# EAGLE design iv12-driver-board-v1 (EAGLE 7.7.0)

## Sheet 1 of 2
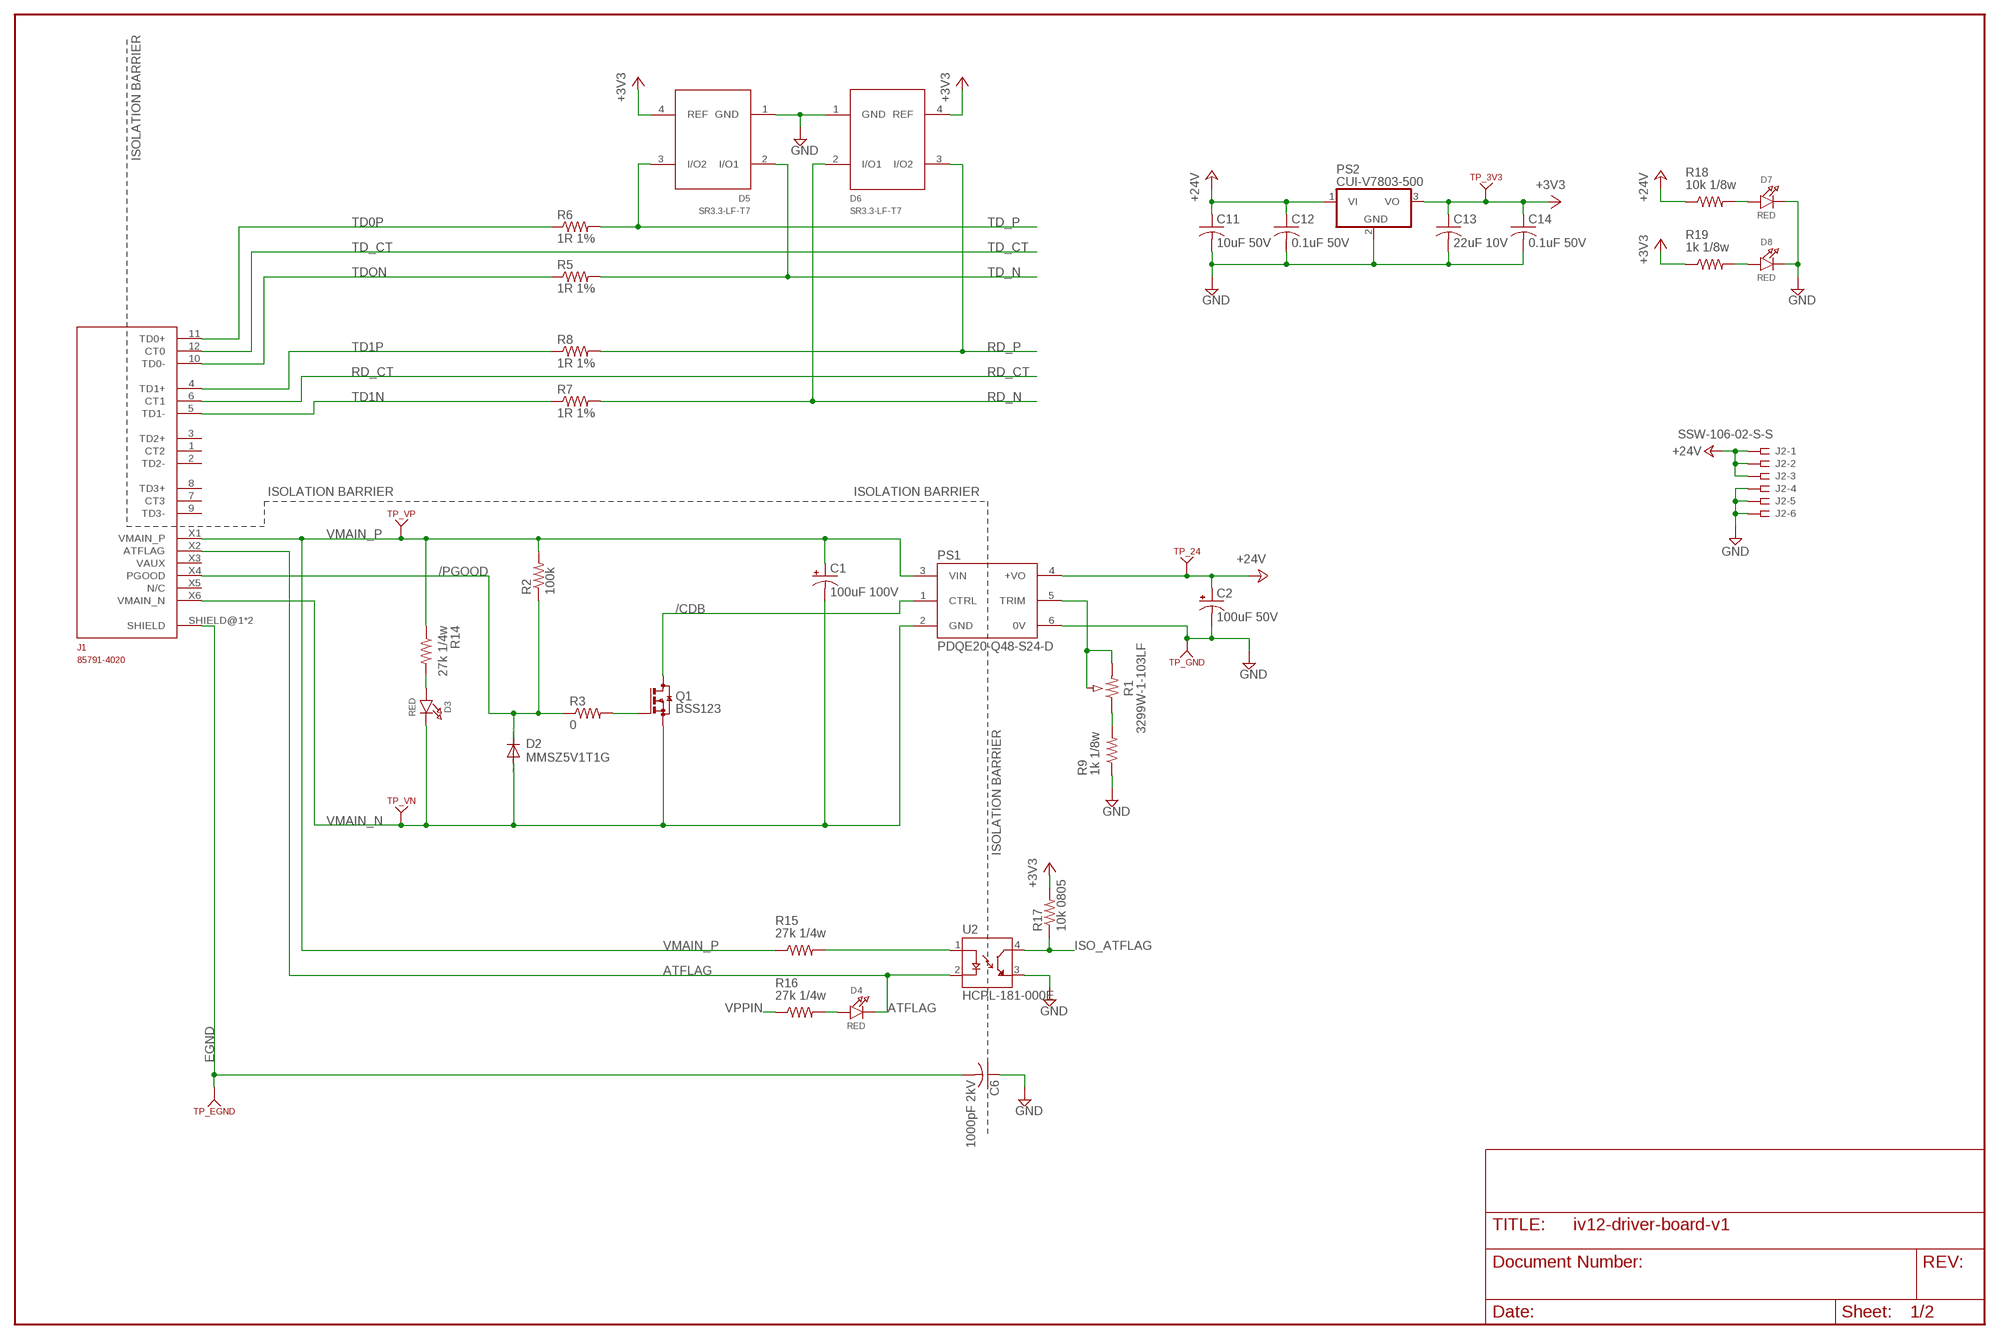
[diagram p0: schematic, sheet 1]

### Parts
C1  100uF 100V  CPOL-USE5-13  [E5-13]
C2  100uF 50V  CPOL-USE5-10.5  [E5-10,5]
C6  1000pF 2kV  C-USC1206K  [C1206K]
C11  10uF 50V  C-USC1210K  [C1210K]
C12  0.1uF 50V  C-USC0805  [C0805]
C13  22uF 10V  C-USC1206K  [C1206K]
C14  0.1uF 50V  C-USC0805  [C0805]
D2  MMSZ5V1T1G  DIODE-SOD123  [SOD123]
D3  RED  LED0805_NOOUTLINE  [CHIPLED_0805_NOOUTLINE]
D4  RED  LED0805_NOOUTLINE  [CHIPLED_0805_NOOUTLINE]
D5  SR3.3-LF-T7  [SOT143B]
D6  SR3.3-LF-T7  [SOT143B]
D7  RED  LED0805_NOOUTLINE  [CHIPLED_0805_NOOUTLINE]
D8  RED  LED0805_NOOUTLINE  [CHIPLED_0805_NOOUTLINE]
J1  85791-4020  [85791-X020]
J2  SSW-106-02-S-S  [SSW-106-02-S-S]
PS1  PDQE20-Q48-S24-D  PDQE20-Q48-S5-D  [CONV_PDQE20-Q48-S5-D]
PS2  CUI-V7803-500  [CUI-78XX-500]
Q1  BSS123  [SOT23]
R1  3299W-1-103LF  [POT_3299W]
R2  100k  R-US_R0805  [R0805]
R3  0  R-US_R0805  [R0805]
R5  1R 1%  R-US_R0805  [R0805]
R6  1R 1%  R-US_R0805  [R0805]
R7  1R 1%  R-US_R0805  [R0805]
R8  1R 1%  R-US_R0805  [R0805]
R9  1k 1/8w  R-US_R0805  [R0805]
R14  27k 1/4w  R-US_R1206  [R1206]
R15  27k 1/4w  R-US_R1206  [R1206]
R16  27k 1/4w  R-US_R1206  [R1206]
R17  10k 0805  R-US_R0805  [R0805]
R18  10k 1/8w  R-US_R0805  [R0805]
R19  1k 1/8w  R-US_R0805  [R0805]
TP_3V3  KEYSTONE_500X  [KEYSTONE_TP500X]
TP_24  KEYSTONE_500X  [KEYSTONE_TP500X]
TP_EGND  KEYSTONE_500X  [KEYSTONE_TP500X]
TP_GND  KEYSTONE_500X  [KEYSTONE_TP500X]
TP_VN  KEYSTONE_500X  [KEYSTONE_TP500X]
TP_VP  KEYSTONE_500X  [KEYSTONE_TP500X]
U2  HCPL-181-000E  [SOIC254P675X240-4N]

### Nets
+3V3: C13.1 C14.1 D5.4(REF) D6.4(REF) PS2.3(VO) R17.2 R19.1 TP_3V3.1 ; also sheet 2
+24V: C2.+ C11.1 C12.1 J2.1 J2.2 J2.3 PS1.4(+VO) PS2.1(VI) R18.1 TP_24.1
/CDB: PS1.1(CTRL) Q1.3(D)
/PGOOD: D2.C J1.X4(PGOOD) R2.1 R3.1
ATFLAG: D4.C J1.X2(ATFLAG) U2.2(CATHODE)
EGND: C6.2 J1.SHIELD@1(SHIELD) J1.SHIELD@2(SHIELD) TP_EGND.1
GND: C2.- C6.1 C11.2 C12.2 C13.2 C14.2 D5.1(GND) D6.1(GND) D7.C D8.C J2.4 J2.5 J2.6 PS1.6(0V) PS2.2(GND) R9.1 TP_GND.1 U2.3(EMITTER) ; also sheet 2
ISO_ATFLAG: R17.1 U2.4(COLLECTOR) ; also sheet 2
N$7: R1.1 R9.2
N$12: R15.2 U2.1(ANODE)
N$16: Q1.1(G) R3.2
N$22: D3.A R14.2
N$23: D4.A R16.2
N$24: D7.A R18.2
N$25: D8.A R19.2
RD_CT: J1.6(CT1) ; also sheet 2
RD_N: D6.2(I/O1) R7.2 ; also sheet 2
RD_P: D6.3(I/O2) R8.2 ; also sheet 2
TD0P: J1.11(TD0+) R6.1
TD1N: J1.5(TD1-) R7.1
TD1P: J1.4(TD1+) R8.1
TD_CT: J1.12(CT0) ; also sheet 2
TD_N: D5.2(I/O1) R5.2 ; also sheet 2
TD_P: D5.3(I/O2) R6.2 ; also sheet 2
TDON: J1.10(TD0-) R5.1
V24ADJ: PS1.5(TRIM) R1.2 R1.3
VMAIN_N: C1.- D2.A D3.C J1.X6(VMAIN_N) PS1.2(GND) Q1.2(S) TP_VN.1
VMAIN_P: C1.+ J1.X1(VMAIN_P) PS1.3(VIN) R2.2 R14.1 R15.1 TP_VP.1
VPPIN: R16.1
Unconnected: J1.1(CT2) J1.2(TD2-) J1.3(TD2+) J1.7(CT3) J1.8(TD3+) J1.9(TD3-) J1.X3(VAUX) J1.X5(N/C)

### Notes on the sheet
- ISOLATION BARRIER
- ISOLATION BARRIER | ISOLATION BARRIER
- ISOLATION BARRIER

## Sheet 2 of 2
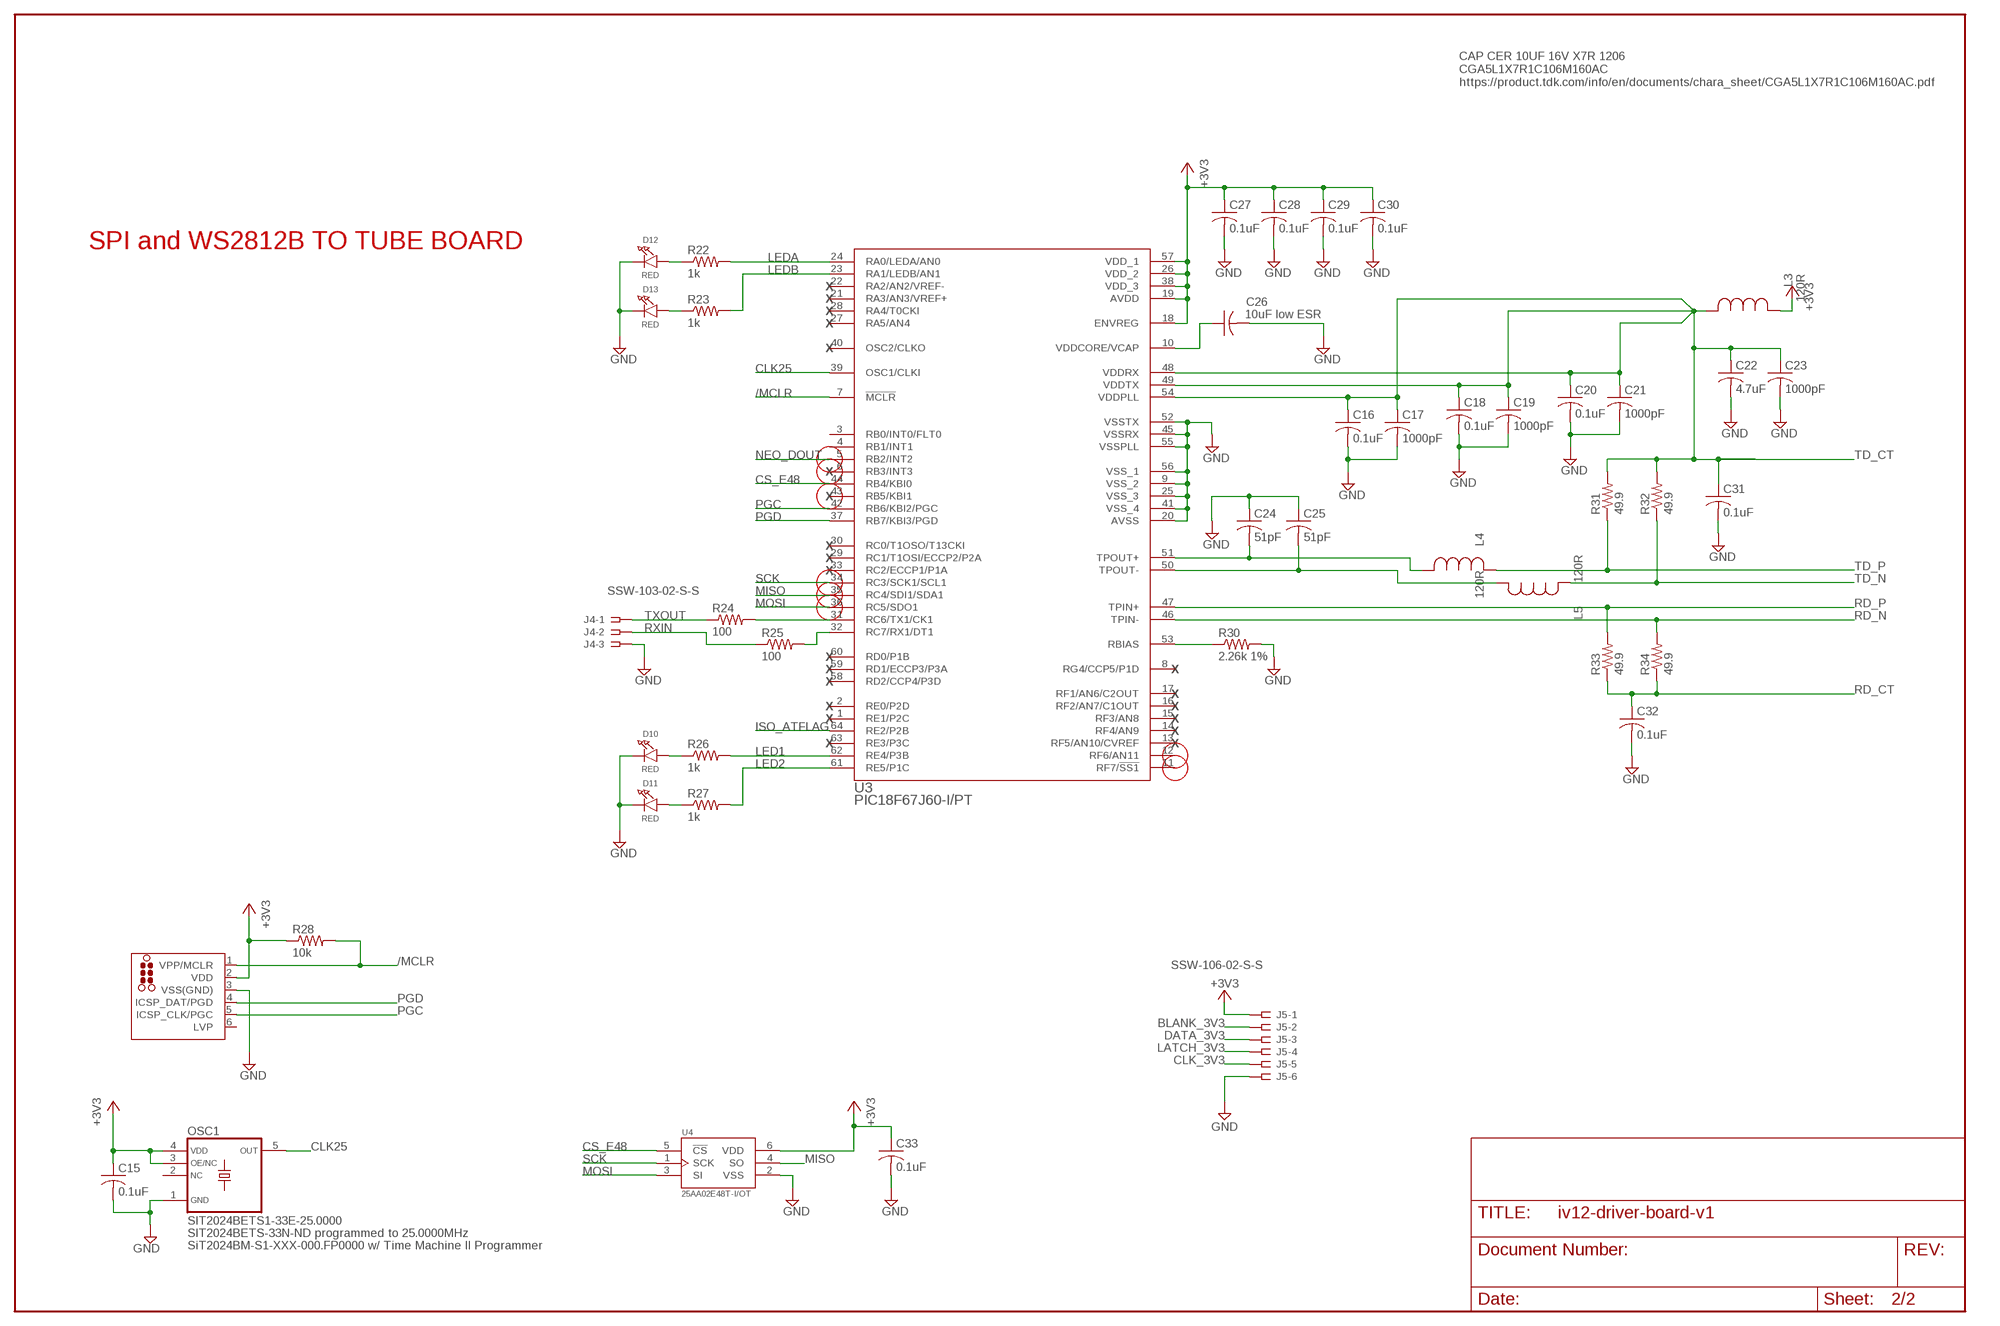
[diagram p1: schematic, sheet 2]

### Parts
C15  0.1uF  C-USC0603  [C0603]
C16  0.1uF  C-USC0805  [C0805]
C17  1000pF  C-USC0805  [C0805]
C18  0.1uF  C-USC0805  [C0805]
C19  1000pF  C-USC0805  [C0805]
C20  0.1uF  C-USC0805  [C0805]
C21  1000pF  C-USC0805  [C0805]
C22  4.7uF  C-USC0805  [C0805]
C23  1000pF  C-USC0805  [C0805]
C24  51pF  C-USC0805  [C0805]
C25  51pF  C-USC0805  [C0805]
C26  10uF low ESR  C-USC1206  [C1206]
C27  0.1uF  C-USC0603  [C0603]
C28  0.1uF  C-USC0603  [C0603]
C29  0.1uF  C-USC0603  [C0603]
C30  0.1uF  C-USC0603  [C0603]
C31  0.1uF  C-USC0805  [C0805]
C32  0.1uF  C-USC0805  [C0805]
C33  0.1uF  C-USC0603  [C0603]
D10  RED  LED0805_NOOUTLINE  [CHIPLED_0805_NOOUTLINE]
D11  RED  LED0805_NOOUTLINE  [CHIPLED_0805_NOOUTLINE]
D12  RED  LED0805_NOOUTLINE  [CHIPLED_0805_NOOUTLINE]
D13  RED  LED0805_NOOUTLINE  [CHIPLED_0805_NOOUTLINE]
J3  TC2030-MCP-NL  [TC2030-MCP-NL]
J4  SSW-103-02-S-S  [SSW-103-02-S-S]
J5  SSW-106-02-S-S  [SSW-106-02-S-S]
L3  120R  MMZ1608B121CTAH0IND_1608-M  [IND_1608-M]
L4  120R  MMZ1608B121CTAH0IND_1608-M  [IND_1608-M]
L5  120R  MMZ1608B121CTAH0IND_1608-M  [IND_1608-M]
OSC1  SIT2024BETS1-33E-25.0000  SIT2024BETS1-33E-10.0000  [SOT23-5]
R22  1k  R-US_R0805  [R0805]
R23  1k  R-US_R0805  [R0805]
R24  100  R-US_R0805  [R0805]
R25  100  R-US_R0805  [R0805]
R26  1k  R-US_R0805  [R0805]
R27  1k  R-US_R0805  [R0805]
R28  10k  R-US_R0805  [R0805]
R30  2.26k 1%  R-US_R0805  [R0805]
R31  49.9  R-US_R0805  [R0805]
R32  49.9  R-US_R0805  [R0805]
R33  49.9  R-US_R0805  [R0805]
R34  49.9  R-US_R0805  [R0805]
U3  PIC18F67J60-I/PT  [TQFP64_10X10MC]
U4  25AA02E48T-I/OT  [SOT95P270X145-6N]

### Nets
+3V3: C15.1 C27.1 C28.1 C29.1 C30.1 C33.1 J3.2(VDD) J5.1 L3.2 OSC1.3(OE/NC) OSC1.4(VDD) R28.1 U3.18(ENVREG) U3.19(AVDD) U3.26(VDD_2) U3.38(VDD_3) U3.57(VDD_1) U4.6(VDD) ; also sheet 1
/MCLR: J3.1(VPP/MCLR) R28.2 U3.7(!MCLR)
BLANK_3V3: J5.2
CLK25: OSC1.5(OUT) U3.39(OSC1/CLKI)
CLK_3V3: J5.5
CS_E48: U3.44(RB4/KBI0) U4.5(!CS)
DATA_3V3: J5.3
GND: C15.2 C16.2 C17.2 C18.2 C19.2 C20.2 C21.2 C22.2 C23.2 C24.1 C25.1 C26.2 C27.2 C28.2 C29.2 C30.2 C31.2 C32.2 C33.2 D10.C D11.C D12.C D13.C J3.3(VSS(GND)) J4.3 J5.6 OSC1.1(GND) R30.2 U3.9(VSS_2) U3.20(AVSS) U3.25(VSS_3) U3.41(VSS_4) U3.45(VSSRX) U3.52(VSSTX) U3.55(VSSPLL) U3.56(VSS_1) U4.2(VSS) ; also sheet 1
ISO_ATFLAG: U3.64(RE2/P2B) ; also sheet 1
LATCH_3V3: J5.4
LED1: R26.2 U3.62(RE4/P3B)
LED2: R27.2 U3.61(RE5/P1C)
LEDA: R22.2 U3.24(RA0/LEDA/AN0)
LEDB: R23.2 U3.23(RA1/LEDB/AN1)
MISO: U3.35(RC4/SDI1/SDA1) U4.4(SO)
MOSI: U3.36(RC5/SDO1) U4.3(SI)
N$8: C26.1 U3.10(VDDCORE/VCAP)
N$9: R30.1 U3.53(RBIAS)
N$10: D13.A R23.1
N$11: D10.A R26.1
N$18: D11.A R27.1
N$21: D12.A R22.1
NEO_DOUT: U3.5(RB2/INT2)
PGC: J3.5(ICSP_CLK/PGC) U3.42(RB6/KBI2/PGC)
PGD: J3.4(ICSP_DAT/PGD) U3.37(RB7/KBI3/PGD)
RD_CT: C32.1 R33.1 R34.1 ; also sheet 1
RD_N: R34.2 U3.46(TPIN-) ; also sheet 1
RD_P: R33.2 U3.47(TPIN+) ; also sheet 1
RXD: R25.2 U3.32(RC7/RX1/DT1)
RXIN: J4.2 R25.1
SCK: U3.34(RC3/SCK1/SCL1) U4.1(SCK)
TD_CT: C16.1 C17.1 C18.1 C19.1 C20.1 C21.1 C22.1 C23.1 C31.1 L3.1 R31.2 R32.2 U3.48(VDDRX) U3.49(VDDTX) U3.54(VDDPLL) ; also sheet 1
TD_N: L5.2 R32.1 ; also sheet 1
TD_P: L4.2 R31.1 ; also sheet 1
TDF_N: C25.2 L5.1 U3.50(TPOUT-)
TDF_P: C24.2 L4.1 U3.51(TPOUT+)
TXD: R24.2 U3.31(RC6/TX1/CK1)
TXOUT: J4.1 R24.1
Unconnected: J3.6(LVP) OSC1.2(NC) U3.1(RE1/P2C) U3.2(RE0/P2D) U3.3(RB0/INT0/FLT0) U3.4(RB1/INT1) U3.6(RB3/INT3) U3.8(RG4/CCP5/P1D) U3.11(RF7/!SS1) U3.12(RF6/AN11) U3.13(RF5/AN10/CVREF) U3.14(RF4/AN9) U3.15(RF3/AN8) U3.16(RF2/AN7/C1OUT) U3.17(RF1/AN6/C2OUT) U3.21(RA3/AN3/VREF+) U3.22(RA2/AN2/VREF-) U3.27(RA5/AN4) U3.28(RA4/T0CKI) U3.29(RC1/T1OSI/ECCP2/P2A) U3.30(RC0/T1OSO/T13CKI) U3.33(RC2/ECCP1/P1A) U3.40(OSC2/CLKO) U3.43(RB5/KBI1) U3.58(RD2/CCP4/P3D) U3.59(RD1/ECCP3/P3A) U3.60(RD0/P1B) U3.63(RE3/P3C)

### Notes on the sheet
- CAP CER 10UF 16V X7R 1206
  CGA5L1X7R1C106M160AC 
  https://product.tdk.com/info/en/documents/chara_sheet/CGA5L1X7R1C106M160AC.pdf
- SPI and WS2812B TO TUBE BOARD
- X
- X
- X
- X
- X
- X
- X
- X
- X
- X
- X
- X | X
- X
- X
- X | X
- X | X
- X
- X | X
- SIT2024BETS-33N-ND programmed to 25.0000MHz
- SiT2024BM-S1-XXX-000.FP0000 w/ Time Machine II Programmer

## Library data of the parts
C1 C2 = rcl:CPOL-US: POLARIZED CAPACITOR, American symbol
C6 C15-C25 C27-C33 = rcl:C-US: CAPACITOR, American symbol
C11 = rcl:C-US: CAPACITOR, American symbol; MFR: KEMET; MFR_PART_NO: C1210C106K5RACTU
C12 C14 = rcl:C-US: CAPACITOR, American symbol; MFR: KEMET; MFR_PART_NO: C1206S104M5RACTU
C13 = rcl:C-US: CAPACITOR, American symbol; MFR: KEMET; MFR_PART_NO: C1206C226K8RAC7800
C26 = resistor:C-US: CAPACITOR, American symbol
D2 = diode:DIODE-: DIODE
D3 D4 D7 D8 D10-D13 = microbuilder:LED: LED 0603 - 0603 Surface Mount Package 2mA: Green LED - Low Power (3.9mcd, 2ma, 1.7Vf) - Digikey: 475-2709-2-ND Orange LED - Low Power (9.8mcd, 2ma, 1.8Vf) - Digikey: 475-1194-2-ND Red LED - Low Power (5mcd, 2ma, 1.8Vf) - Digikey: 475-1195-2-ND Yellow LED - Low Power (7mcd, 2ma, 1.8Vf) - Digikey: 475-1196-2-ND 5mA: Blue LED - Low Power (17mcd, 5ma, 2.9Vf) - Digikey: LNJ937W8CRACT-ND 0805 - 0805 Surface Mount Package 2mA: Red LED (8.8mcd, 2mA, 1.8Vf, Clear) - Low Power [Digikey: 475-2510-1-ND] Green LED (5mcd, 2mA, 1.8Vf, Clear) - Low Power [Digikey: 475-2730-1-ND] Yellow LED (11.3mcd, 2mA, 1.8Vf, Clear) - Low Power [Digikey: 475-2555-1-ND] 20mA: Red LED (104mcd, 20mA, Diffused) - LS R976 [Digikey: 475-1278-6-ND] Red LED (12mcd, 20mA, 2.0Vf, Clear) - APT2012EC [Digikey: 754-1128-1-ND] Green LED (15mcd, 20mA, 2.2Vf, Clear) - APT2012GC [Digikey: 754-1131-1-ND] Orange LED (160mcd, 20mA, 2.1Vf, Clear) - APT2012SECK [Digikey: 754-1130-1-ND] 1206 - 1206 Surface Mount Package Green LED (26mcd, 20mA, Diffused) - LG N971 [Digikey: 475-1407-6-ND] Red LED (15mcd, 20mA, Diffused) - LH N974 [Digikey: 475-1416-6-ND] Cree - Cree High-Power Surface Mount LEDs XPEBWT-L1-0000-00D50 - White 111lm 350mA 2.9Vf 6200K 110° XTEAWT-00-0000-00000LEE3 - White 114lm 350mA 2.85Vf 5000K 115° Everlight - Everlight 45-21 Series Surface Mount LEDs 45-21/QK2C-B2832AC2CB2/2T - Warm White 2000mcd 20mA 3.25Vf 3050K 120° 45-21/LK2C-B38452C4CB2/2T - Nuetral White 2000mcd 20mA 3.25Vf 4150K 120° 45-21/LK2C-B50634C6CB2/2T - Cold White 2200mcd 20mA 3.25Vf 5650K 120° PLCC2 Reverse Mount LS T77K-J1L2-1-0-2-R18-Z - Red 11.25mcd 2mA 1.8Vf 630nm 120° LO T77K-L1M2-24-Z - Orange 19.6mcd 2mA 1.8Vf 606nm 120° LY T77K-K2M1-26-Z - Yellow 15.7mcd 2mA 1.8Vf 587nm 120°
D5 D6 = protek-devices:SR3.3-LF-T7
J1 = Molex 85791-X020:85791-4020
J2 J5 = con-samtec:SSW-106-02-S-S: THROUGH-HOLE .025" SQ POST SOCKET Source: Samtec SSW.pdf; MPN: SSW-106-02-S-S; OC_FARNELL: unknown; OC_NEWARK: 11P9416
J3 = tag-connect:TC2030: TAG-CONNECT ICSP Connector Manufacturer: Tag-Connect <http://www.tag-connect.com> Cable for easy In-Circuit Serial Programming. Designed for Microchip ICD2, suitable for many others. Two variants - one "with legs" (for hands-free fit on PCB) and another "without legs" for quick programming. PAD Description 1 MCLR/Vpp 2 Vdd 3 GND 4 PGD (ISPDAT) 5 PGC (ISPCLK) 6 nc (used for LVP) ©2009 ROFA.cz - modified and updated by Robert Darlington ‹rdarlington@gmail.com›
J4 = con-samtec:SSW-103-02-S-S: THROUGH-HOLE .025" SQ POST SOCKET Source: Samtec SSW.pdf; MPN: SSW-103-02-S-S; OC_FARNELL: unknown; OC_NEWARK: 11P9367
L3-L5 = MMZ1608B121CTAH0:MMZ1608B121CTAH0; BUILT_BY: EMA_UL_Team; MANUFACTURER_PART_NUMBER: MMZ1608B121CTAH0; VENDOR: TDK
OSC1 = Glen-SiTime:SIT2024BETS1-33E-10.0000
PS1 = PDQE20-Q48-S5-D:PDQE20-Q48-S5-D: 20 W, 4:1 Input Range, Single/Dual Regulated Output, DIP, 1500 Vdc Isolation, DC-Dc Converter; CUI_PURCHASE_URL: https://www.cui.com/product/dc-dc-converters/isolated/pdqe20-d-series?utm_source=snapeda.com&utm_medium=referral&utm_campaign=snapedaBOM; DESCRIPTION: 20 W, 4:1 Input Range, Single/Dual Regulated Output, DIP, 1500 Vdc Isolation, Dc-Dc Converter; DIGI-KEY_PART_NUMBER: 102-6272-ND; DIGI-KEY_PURCHASE_URL: https://www.digikey.com/product-detail/en/cui-inc/PDQE20-Q48-S5-D/102-6272-ND/10230161?utm_source=snapeda&utm_medium=aggregator&utm_campaign=symbol; MF: CUI Inc.; MP: PDQE20-Q48-S5-D; PACKAGE: DIP-6 CUI Inc.
PS2 = GlenPartsLibrary:CUI-V7803-500
Q1 = transistor-small-signal:BSS123: N-CHANNEL MOS FET
R1 = bourns-3299w:3299W-1-103LF
R2 R3 R17 = resistor:R-US_: RESISTOR, American symbol
R5-R9 R14-R16 R18 R19 R22-R28 R30-R34 = rcl:R-US_: RESISTOR, American symbol
TP_3V3 TP_24 TP_EGND TP_GND TP_VN TP_VP = 0GlenConnectors:KEYSTONE_500X
U2 = HCPL-181-000E:HCPL-181-000E: Optocoupler; SMD; Channels: 1; Out: transistor; Uinsul: 3.75kV; SO4; DESCRIPTION: Optocoupler; SMD; Channels: 1; Out: transistor; Uinsul: 3.75kV; SO4; DIGI-KEY_PART_NUMBER: 516-1646-1-ND; DIGI-KEY_PURCHASE_URL: https://www.digikey.com/product-detail/en/broadcom-limited/HCPL-181-000E/516-1646-1-ND/825340?utm_source=snapeda&utm_medium=aggregator&utm_campaign=symbol; MF: Broadcom Limited; MP: HCPL-181-000E; PACKAGE: SO-4 Broadcom
U3 = pic18f67j60:PIC18F67J60-I/PT; MANUFACTURER_PART_NUMBER: PIC18F67J60IPT; VENDOR: Microchip
U4 = 25AA02E48T-I_OT:25AA02E48T-I/OT: 25AA02E48 Series 2 Kbit (256 x 8) 5.5 V SMT SPI Bus Serial EEPROM - SOT-23-6; DESCRIPTION: 25AA02E48 Series 2 Kbit _256 x 8_ 5.5 V SMT SPI Bus Serial EEPROM - SOT-23-6; DIGI-KEY_PART_NUMBER: 25AA02E48T-I/OTCT-ND; DIGI-KEY_PURCHASE_URL: https://www.digikey.com/product-detail/en/microchip-technology/25AA02E48T-I-OT/25AA02E48T-I-OTCT-ND/2060055?utm_source=snapeda&utm_medium=aggregator&utm_campaign=symbol; MF: Microchip; MP: 25AA02E48T-I/OT; PACKAGE: SOT-23-6 Microchip

## Board
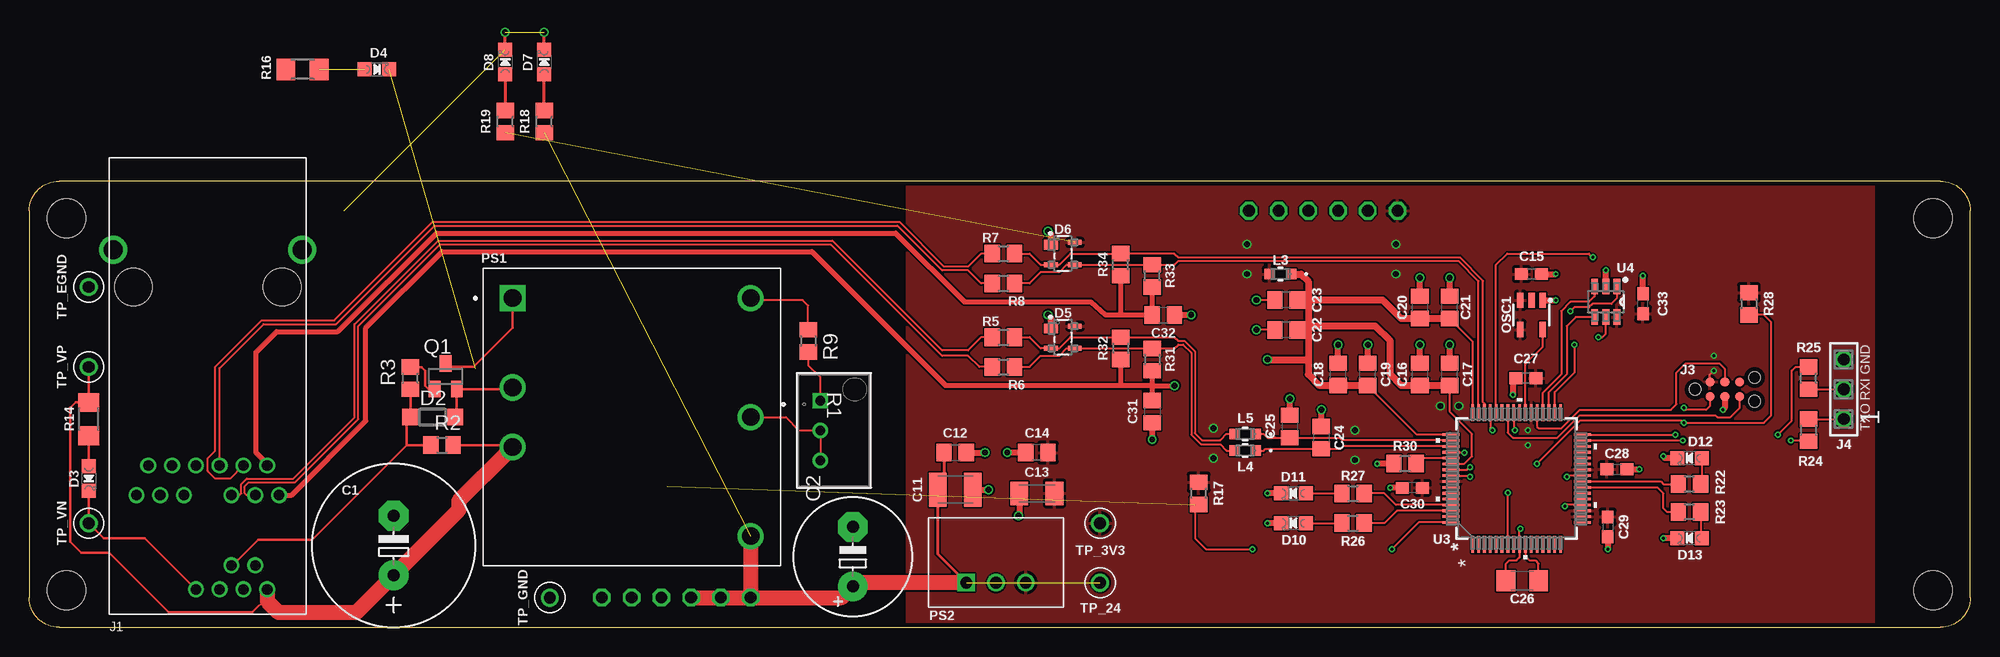
[diagram p2: board, top side]
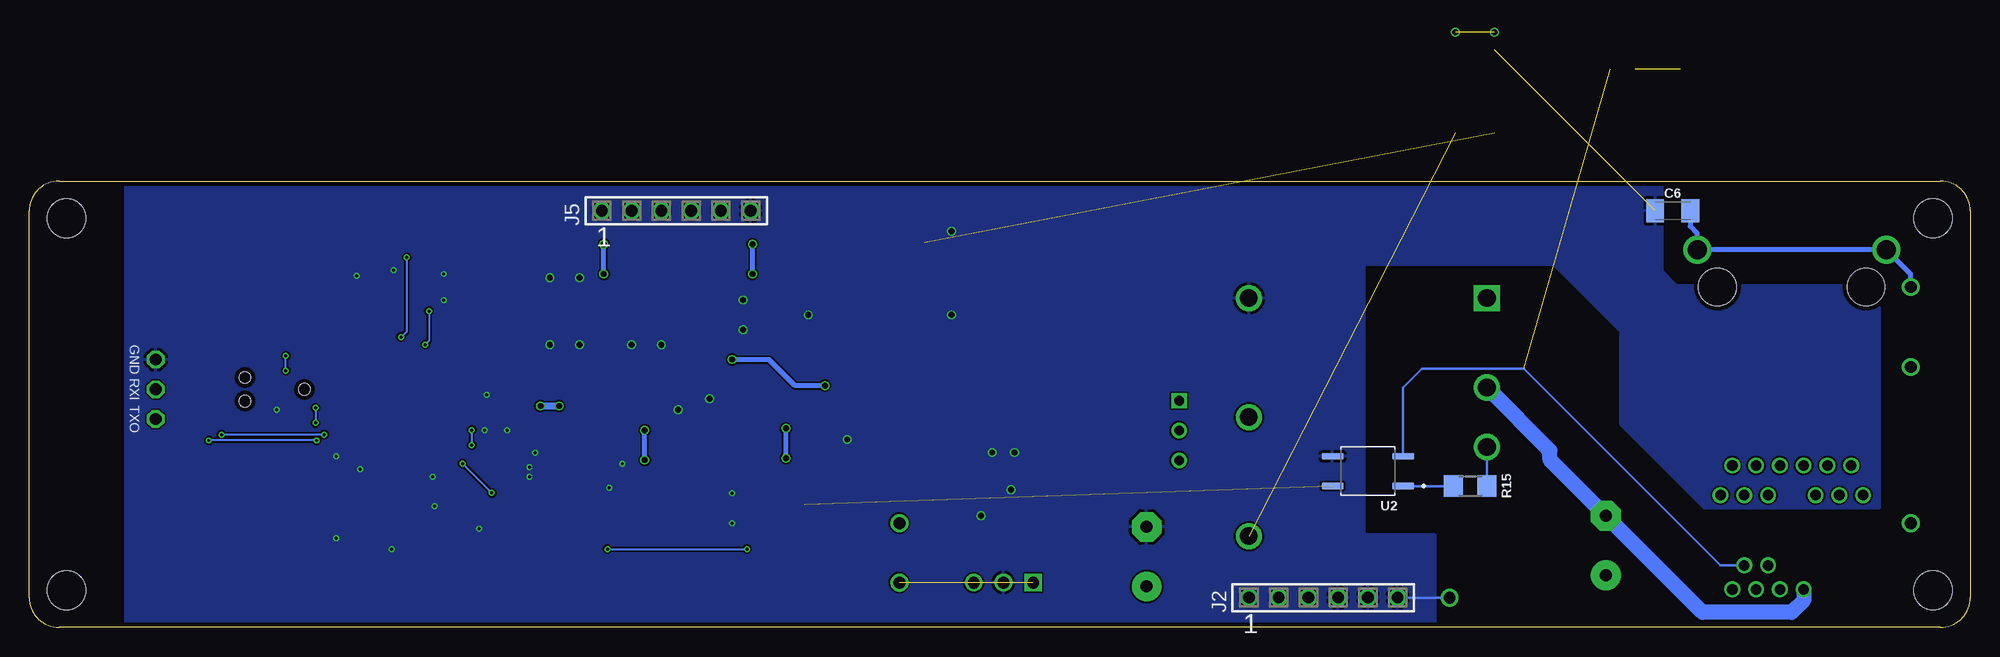
[diagram p3: board, bottom side, seen from below]

Size 165.74 x 38.1 mm. Coordinates in mm from the lower left corner, seen from the top.
Outline: 2.54,0 163.2,0 arc90 165.74,2.54 165.74,35.56 arc90 163.2,38.1 2.54,38.1 arc90 0,35.56 0,2.54 arc90 2.54,0
Copper layers (1*16): Top 0.035559375mm / dielectric 1.6mm / Bottom 0.035559375mm
Design rules "oshpark-2layer-2018": minimum track width 6mil, minimum drill 10mil, track to track 6mil, track to pad 6mil, pad to pad 6mil, via to via 6mil, smd to smd 6mil, copper to edge 15mil, drill to drill 6mil, minimum pad ring 5mil, minimum via ring 5mil, stop-mask expansion 2.5mil, vias tented up to drill 0mil, thermal gap 10mil
Holes 3.3 mm at 3.17,3.17 162.56,34.92 3.17,34.92 162.56,3.17

### Footprints (pad centres in the part's own frame; a part is rotated, then mirrored left to right if it is on the bottom)
E5-13 = drill 1.016 pad 2.54: + -2.54,0 | drill 1.016 pad 2.54 octagon: - 2.54,0
E5-10,5 = drill 1.016 pad 2.54: + -2.54,0 | drill 1.016 pad 2.54 octagon: - 2.54,0
C1206K = smd 1.5 x 2: 1 -1.5,0; 2 1.5,0
C1210K = smd 1.5 x 2.9: 1 -1.5,0; 2 1.5,0
C0805 = smd 1.3 x 1.5: 1 -0.95,0; 2 0.95,0
C0603 = smd 1.1 x 1: 1 -0.85,0; 2 0.85,0
C1206 = smd 1.6 x 1.8: 1 -1.4,0; 2 1.4,0
SOD123 = smd 1.4 x 1.4: A 1.9,0; C -1.9,0
CHIPLED_0805_NOOUTLINE = smd 1.2 x 1.2: A 0,-1.05; C 0,1.05
SOT143B = smd 0.838 x 1.168: 1 -0.747,-1.016 | smd 0.432 x 1.168: 2 0.95,-1.016; 3 0.95,1.016; 4 -0.95,1.016
85791-X020 = drill 0.9: 1 15.24,-5.075; 2 15.24,-3.045; 3 15.24,-1.015; 4 15.24,1.015; 5 15.24,3.045; 6 15.24,5.075; 7 17.78,-6.09; 8 17.78,-4.06; 9 17.78,-2.03; 10 17.78,2.03; 11 17.78,4.06; 12 17.78,6.09; X1 25.81,5.075; X2 23.77,4.06; X3 25.81,3.045; X4 23.77,2.03; X5 25.81,1.015; X6 25.81,-1.015 | drill 1.6: SHIELD@1 -3.18,8.065; SHIELD@2 -3.18,-8.065 | hole 3.2: 0,-6.35; 0,6.35
SSW-106-02-S-S = drill 1 pad 1.5 octagon: 1 -6.35,0; 2 -3.81,0; 3 -1.27,0; 4 1.27,0; 5 3.81,0; 6 6.35,0
TC2030-MCP-NL = smd 0.787 x 0.787: 1 1.27,-0.635; 2 1.27,0.635; 3 2.54,-0.635; 4 2.54,0.635; 5 3.81,-0.635; 6 3.81,0.635 | hole 0.991: 0,0; 5.08,-1.016; 5.08,1.016
SSW-103-02-S-S = drill 1 pad 1.5 octagon: 1 -2.54,0; 2 0,0; 3 2.54,0
IND_1608-M = smd 0.859 x 0.902: 1 -0.929,0; 2 0.929,0
SOT23-5 = smd 1.3 x 0.55: 1 -1.25,0.95; 2 -1.25,0; 3 -1.25,-0.95; 4 1.25,-0.95; 5 1.25,0.95
CONV_PDQE20-Q48-S5-D = drill 1.5 square: 1 -10.16,10.16 | drill 1.5: 2 -10.16,2.54; 3 -10.16,-2.54; 4 10.16,-10.16; 5 10.16,0; 6 10.16,10.16
CUI-78XX-500 = drill 1 square: 1 0,0 | drill 1: 2 2.54,0; 3 5.08,0
SOT23 = smd 1 x 1.4: 1 -0.95,-1.1; 2 0.95,-1.1; 3 0,1.1
POT_3299W = drill 0.813 pad 1.321 square: 1 -5.055,-2.286 | drill 0.813 pad 1.321: 2 -2.515,-2.286; 3 0.025,-2.286
R0805 = smd 1.3 x 1.5: 1 -0.95,0; 2 0.95,0
R1206 = smd 1.6 x 1.803: 1 -1.422,0; 2 1.422,0
KEYSTONE_TP500X = drill 1.016: 1 0,0
SOIC254P675X240-4N = smd 1.89 x 0.59: 1 -3.01,1.27; 2 -3.01,-1.27; 3 3.01,-1.27; 4 3.01,1.27
TQFP64_10X10MC = smd 1.473 x 0.229: 1 -5.613,3.75; 2 -5.613,3.25; 3 -5.613,2.75; 4 -5.613,2.25; 5 -5.613,1.75; 6 -5.613,1.25; 7 -5.613,0.75; 8 -5.613,0.25; 9 -5.613,-0.25; 10 -5.613,-0.75; 11 -5.613,-1.25; 12 -5.613,-1.75; 13 -5.613,-2.25; 14 -5.613,-2.75; 15 -5.613,-3.25; 16 -5.613,-3.75; 33 5.613,-3.75; 34 5.613,-3.25; 35 5.613,-2.75; 36 5.613,-2.25; 37 5.613,-1.75; 38 5.613,-1.25; 39 5.613,-0.75; 40 5.613,-0.25; 41 5.613,0.25; 42 5.613,0.75; 43 5.613,1.25; 44 5.613,1.75; 45 5.613,2.25; 46 5.613,2.75; 47 5.613,3.25; 48 5.613,3.75 | smd 0.229 x 1.473: 17 -3.75,-5.613; 18 -3.25,-5.613; 19 -2.75,-5.613; 20 -2.25,-5.613; 21 -1.75,-5.613; 22 -1.25,-5.613; 23 -0.75,-5.613; 24 -0.25,-5.613; 25 0.25,-5.613; 26 0.75,-5.613; 27 1.25,-5.613; 28 1.75,-5.613; 29 2.25,-5.613; 30 2.75,-5.613; 31 3.25,-5.613; 32 3.75,-5.613; 49 3.75,5.613; 50 3.25,5.613; 51 2.75,5.613; 52 2.25,5.613; 53 1.75,5.613; 54 1.25,5.613; 55 0.75,5.613; 56 0.25,5.613; 57 -0.25,5.613; 58 -0.75,5.613; 59 -1.25,5.613; 60 -1.75,5.613; 61 -2.25,5.613; 62 -2.75,5.613; 63 -3.25,5.613; 64 -3.75,5.613
SOT95P270X145-6N = smd 1.321 x 0.559: 1 -1.295,0.94; 2 -1.295,0; 3 -1.295,-0.94; 4 1.295,-0.94; 5 1.295,0; 6 1.295,0.94

### Placement (x,y rotation side)
C1  31.12,6.99 90 top
C2  70.33,6.03 90 top
C6  25.4,35.56 0 bottom
C11  79.06,11.75 0 top
C12  79.06,14.92 0 top
C13  86.04,11.43 180 top
C14  86.04,14.92 180 top
C15  128.27,30.16 0 top
C16  118.75,21.59 90 top
C17  121.28,21.59 90 top
C18  111.76,21.59 90 top
C19  114.3,21.59 90 top
C20  118.75,27.3 90 top
C21  121.28,27.3 90 top
C22  107.31,25.4 180 top
C23  107.31,27.94 180 top
C24  110.33,16.19 270 top
C25  107.63,17.14 270 top
C26  127.48,3.97 180 top
C27  127.79,21.27 180 top
C28  135.57,13.49 0 top
C29  134.78,8.57 270 top
C30  118.11,11.91 180 top
C31  95.89,18.41 270 top
C32  96.84,26.67 0 top
C33  137.8,27.62 90 top
D2  34.45,17.94 0 top
D3  5.08,12.7 180 top
D4  29.69,47.62 270 top  (outside the outline)
D5  88.27,24.77 270 top
D6  88.27,31.91 270 top
D7  43.97,48.26 0 top  (outside the outline)
D8  40.64,48.26 0 top  (outside the outline)
D10  107.95,8.89 90 top
D11  107.95,11.43 90 top
D12  141.76,14.45 90 top
D13  141.76,7.62 90 top
J1  15.24,29.06 270 top
J2  55.24,2.54 0 bottom
J3  142.24,20.32 0 top
J4  154.94,20.32 90 top
J5  110.49,35.56 0 bottom
L3  106.84,30.16 180 top
L4  103.82,15.08 180 top
L5  103.82,16.51 180 top
OSC1  128.27,26.67 270 top
PS1  51.43,17.94 0 top
PS2  80.01,3.81 0 top
Q1  35.56,21.43 0 top
R1  69.85,14.29 270 top
R2  35.24,15.56 0 top
R3  32.54,21.27 90 top
R5  83.19,24.77 0 top
R6  83.19,22.23 0 top
R7  83.19,31.91 0 top
R8  83.19,29.37 0 top
R9  66.52,24.45 270 top
R14  5.08,17.78 270 top
R15  42.7,12.06 180 bottom
R16  23.34,47.62 0 top  (outside the outline)
R17  99.85,11.43 90 top
R18  43.97,43.18 90 top  (outside the outline)
R19  40.64,43.18 90 top  (outside the outline)
R22  141.76,12.22 180 top
R23  141.76,9.84 180 top
R24  151.92,16.83 270 top
R25  151.92,21.27 90 top
R26  113.03,8.89 0 top
R27  113.03,11.43 0 top
R28  146.84,27.62 270 top
R30  117.47,13.97 180 top
R31  95.89,22.86 270 top
R32  93.19,23.81 270 top
R33  95.89,30 90 top
R34  93.19,30.96 90 top
TP_3V3  91.44,8.89 180 top
TP_24  91.44,3.81 0 top
TP_EGND  5.08,29.06 90 top
TP_GND  44.45,2.54 180 top
TP_VN  5.08,8.89 90 top
TP_VP  5.08,22.23 90 top
U2  51.43,13.34 180 bottom
U3  127,12.7 90 top
U4  134.62,27.78 270 top

### Tracks (layer width: path | path; a pad name or v marks a point on that pad's centre or on a via)
+3V3  (via drill 0.25, 0.5)  (1 unrouted)
  Top 0.152: J3.2 143.51,21.59 v143.83,21.91
  Bottom 0.152: v143.83,21.91 v143.83,23.18 | v127.95,16.83 v127.95,15.56
  Bottom 0.406: v103.98,30.16 v103.98,32.7 | v101.12,14.45 v101.12,16.99 | v113.19,14.29 v113.19,16.83 | v116.68,30.16 v116.68,32.7
  Bottom 0.61: v120.49,18.89 v122.08,18.89
  pour Top (isolate 0.152, rank 2): 74.93,38.1 74.93,0 157.48,0 157.48,38.1
+24V  (2 unrouted)
  Top 0.254: C12.1 78.11,12.3 C11.1 77.56,6.26 PS2.1
  Top 1.27: J2.3 J2.2 J2.1 | PS1.4 J2.1 | J2.1 69.37,2.54 C2.+ 70.64,3.81 PS2.1
/CDB
  Top 0.152: 35.73,22.23 Q1.3
  Top 0.203: PS1.1 41.27,25.56 37.94,22.23 35.73,22.23
/MCLR  (via drill 0.25)
  Top 0.152: U3.7 v126.25,11.47 | J3.1 143.51,18.89 143.19,18.57 141.45,18.57 v141.29,18.73 | v128.75,13.97 132.4,17.62 141.13,17.62 v141.29,17.46 148.11,17.46 148.75,18.1 148.75,26.04 148.11,26.67 R28.2
  Bottom 0.152: v141.29,18.73 v141.29,17.46 | v126.25,11.47 v128.75,13.97
/PGOOD
  Top 0.152: D2.C 32.23,17.62
  Top 0.203: 32.23,15.56 24.13,7.46 19.53,7.46 17.35,5.29 J1.X4 | R3.1 D2.C | R2.1 32.23,15.56 | 32.23,15.56 32.23,17.62
ATFLAG  (1 unrouted)
  Bottom 0.203: J1.X2 21.32,5.29 38.1,22.07 46.83,22.07 48.42,20.47 U2.2
CLK25
  Top 0.152: U3.39 127.75,22.5 129.22,23.97 OSC1.5
  Top 0.254: OSC1.5
CS_E48  (via drill 0.25)
  Top 0.152: U3.44 125.25,30.95 126.21,31.91 133.19,31.91 v133.51,31.59 | v133.99,24.77 134.3,24.77 134.62,25.08 U4.5
  Bottom 0.152: v133.51,31.59 133.51,25.24 v133.99,24.77
EGND
  Bottom 0.406: TP_EGND.1 5.08,30.14 J1.SHIELD@2 J1.SHIELD@1 23.34,32.27 23.34,33.66 23.9,34.22 C6.2
GND  (via drill 0.25, 0.5)  (2 unrouted)
  Top 0.152: C23.2 v104.77,27.94 | C22.2 v104.77,25.4 | v127.32,8.41 127.25,8.35 U3.9 127.25,5.96 127,5.71 126.36,5.71 126.08,5.43 C26.2 | U3.20 131.26,10.45 v131.13,10.32 | U3.25 131.38,12.95 v131.29,12.86 | U3.41 126.75,16.92 v126.84,16.83 | U3.45 124.75,17.01 v124.94,16.83 | U3.52 122.53,14.95 v122.55,14.92 | U3.55 122.76,13.45 v123.03,13.65 | U3.56 122.94,12.95 v123.03,12.86 | 130.31,27.92 v130.33,27.94 | C27.2 126.84,21.27 126.68,21.11 | R9.1 66.52,27.46 66.04,27.94 61.75,27.94 PS1.6
  Top 0.254: D7.C v43.97,50.8 | D8.C v40.64,50.8
  Top 0.508: C20.2 v118.75,29.84 | C21.2 v121.28,29.84 | C17.2 v121.28,24.13 | C16.2 v118.75,24.13 | C19.2 v114.3,24.13 | C18.2 v111.76,24.13 | C32.2 v99.22,26.67 | D6.1 87.25,33.56 v87,33.81 | D5.1 87.25,26.42 v87,26.67 | C25.1 v107.63,19.53 | C24.1 v110.33,18.57 | C12.2 v81.6,14.92 | C14.2 v83.5,14.92 | C11.2 v81.91,11.75 | C31.2 v95.89,16.03 | D10.C v105.73,8.89 | D11.C v105.73,11.43 | R30.2 v115.09,13.97 | OSC1.1 130.31,27.92 | U4.2 v134.62,30.48 | C33.2 v137.8,30 | J3.3 144.78,18.73 v144.62,18.57 | C28.2 v137.48,13.49 | C29.2 v134.78,6.67 | C30.2 v116.2,11.91 | 126.68,21.11 v126.68,19.84 | C15.2 v130.33,30.16 | D12.C 139.7,14.45 v139.54,14.61 | D13.C v139.54,7.62 | C13.2 84.54,9.61 v84.45,9.53
  Bottom 0.203: TP_GND.1 J2.6
  pour Bottom (isolate 0.152): 74.93,38.1 26.35,37.94 26.35,30.48 25.08,29.21 7.78,29.21 7.78,10.16 22.7,10.16 29.84,17.3 29.84,25.24 35.56,30.96 51.75,30.96 51.75,7.94 45.72,7.94 45.72,0 157.48,0 157.48,38.1
ISO_ATFLAG  (via drill 0.25)  (1 unrouted)
  Top 0.152: U3.64 118.65,8.95 v116.36,6.67 | R17.1 99.54,10.48 99.54,7.62 100.49,6.67 v104.46,6.67
  Bottom 0.152: v116.36,6.67 v104.46,6.67
LED1
  Top 0.152: U3.62 116.79,9.95 115.73,8.89 R26.2
LED2
  Top 0.152: U3.61 116.71,10.45 115.73,11.43 R27.2
LEDA
  Top 0.152: U3.24 139.32,12.45 139.54,12.22 R22.2
LEDB
  Top 0.152: U3.23 139.02,11.95 139.54,11.43 139.54,10.16 139.86,9.84 R23.2
MISO
  Top 0.152: 133.67,26.47 U4.4 132.06,26.49 131.29,25.72 131.29,21.59 129.75,20.05 U3.35
MOSI
  Top 0.152: U4.3 133.66,29.05 133.66,28.25 133.19,27.78 131.6,27.78 130.81,26.99 130.81,21.59 129.25,20.03 U3.36
N$7
  Top 0.152: R9.2 66.52,22.38 67.56,21.34 R1.1
N$8
  Top 0.152: U3.10 127.75,6.08 128.11,5.71 128.59,5.71 128.88,5.43 C26.1
N$9
  Top 0.152: U3.53 118.91,14.45 R30.1
N$10
  Top 0.152: R23.1 142.71,7.72 D13.A
N$11
  Top 0.152: D10.A R26.1
N$12
  Bottom 0.203: R15.2 U2.1
N$16
  Top 0.203: R3.2 33.5,22.22 33.81,21.91 33.81,20.64 34.12,20.33 Q1.1
N$18
  Top 0.152: D11.A R27.1
N$21
  Top 0.152: D12.A 142.81,12.32 R22.1
N$22
  Top 0.203: R14.2 D3.A
N$23  (1 unrouted)
N$24
  Top 0.254: R18.2 D7.A
N$25
  Top 0.254: D8.A R19.2
PGC
  Top 0.152: U3.42 126.25,16.62 126.68,16.19 130.49,16.19 132.4,18.1 143.99,18.1 144.15,17.94 145.26,17.94 146.05,18.73 J3.5
PGD
  Top 0.152: U3.37 128.75,17.14 128.91,16.99 130.81,16.99 132.4,18.57 140.18,18.57 140.65,19.05 140.65,21.75 141.45,22.54 144.3,22.54 144.78,22.07 J3.4
RD_CT
  Top 0.406: 93.19,26.67 91.92,26.67 90.65,27.78 79.85,27.78 73.98,33.66 34.77,33.66 26.35,25.24 21.11,25.24 19.37,23.5 19.37,14.92 20.31,13.97 J1.6 | 93.19,26.67 C32.1 95.89,28.1 R33.1 | R34.1 93.19,26.67
RD_N
  Top 0.152: R7.2 85.41,31.91 86.36,30.96 D6.2 87.95,30.96 88.9,31.91 R34.2 | 93.51,32.23 93.51,31.91 | 93.51,31.91 93.5,31.91 | U3.46 124.25,19.1 124.14,19.21 124.14,29.58 122.14,31.59 98.11,31.59 97.78,31.91 R34.2 | R34.2 93.51,31.91
RD_P
  Top 0.152: U3.47 123.75,29.55 122.02,31.28 98.11,31.28 97.78,30.96 R33.2 D6.3 88.58,30.96 87.95,30.32 86.36,30.32 85.41,29.37 R8.2
RXD  (via drill 0.25)
  Top 0.152: U3.32 v140.55,16.45 | v149.32,16.45 150.5,17.62 150.5,21.91 150.81,22.22 R25.2
  Bottom 0.152: v140.55,16.45 v149.32,16.45
RXIN
  Top 0.152: R25.1 J4.2
SCK  (via drill 0.25)
  Top 0.152: 135.57,29.06 U4.1 135.56,28.09 135.1,27.62 133.51,27.62 133.19,27.3 131.92,27.3 v131.6,26.99 | v131.92,24.13 131.92,21.75 130.25,20.08 U3.34
  Bottom 0.152: v131.6,26.99 131.6,24.45 v131.92,24.13
TD0P
  Top 0.152: J1.11 18.57,11.28 18.41,11.43 18.41,12.06 18.73,12.38 22.7,12.38 28.1,17.78 28.1,25.72 35.08,32.7 68.42,32.7 77.95,23.18 80.17,23.18 81.12,22.23 R6.1
TD1N
  Top 0.152: J1.5 18.26,13.82 17.14,12.7 15.88,12.7 15.24,13.34 15.24,14.45 15.88,15.08 15.88,22.23 19.84,26.19 26.03,26.19 34.45,34.61 74.3,34.61 78.11,30.8 80.17,30.8 81.28,31.91 R7.1
TD1P
  Top 0.152: J1.4 16.26,22.13 20,25.88 26.19,25.88 34.61,34.29 74.14,34.29 77.95,30.48 80.17,30.48 81.28,29.37 R8.1
TD_CT  (via drill 0.5)
  Top 0.152: 121.28,16.55 U3.49 118.49,16.45 C19.1 | U3.48 123.25,24.39 C21.1 | U3.54 122.53,13.95 123.19,14.61 123.19,16.51 121.28,18.41 C17.1
  Top 0.406: C31.1 95.89,20.64 | 95.89,20.64 93.19,20.64 | 93.19,20.64 78.26,20.64 66.83,32.07 35.24,32.07 28.73,25.56 28.73,17.62 22.39,11.28 J1.12 | R32.2 93.19,20.64 | R31.2 95.89,20.64 | 95.89,20.64 v97.79,20.64
  Top 0.61: 109.22,27.94 109.22,25.72 | 109.22,25.72 109.22,22.86 | 109.22,22.86 109.22,21.59 110.17,20.64 C18.1 C19.1 | C23.1 109.22,27.94 | C22.1 109.22,25.72 | C17.1 C16.1 117.16,20.64 116.2,21.59 116.2,24.45 114.94,25.72 109.22,25.72 | C21.1 C20.1 117.16,26.36 115.57,27.94 109.22,27.94 | L3.1 108.58,30.16 109.22,29.53 109.22,27.94 | v105.73,22.86 109.22,22.86
  Bottom 0.406: v97.79,20.64 100.33,20.64 102.55,22.86 v105.73,22.86
TD_N
  Top 0.152: R5.2 85.41,24.77 86.36,23.82 D5.2 87.95,23.82 88.9,24.77 R32.1 97.79,24.76 97.79,24.77 98.11,24.45 98.64,24.45 99.53,23.56 99.53,16.57 100.12,15.98 101.71,15.98 102.23,16.51 L5.2
TD_P
  Top 0.152: L4.2 102.23,15.08 101.71,15.61 100.06,15.61 99.22,16.45 99.22,23.43 98.53,24.13 98.11,24.13 97.79,23.82 R31.1 D5.3 88.58,23.81 87.95,23.18 86.36,23.18 85.41,22.23 R6.2
TDF_N
  Top 0.152: L5.1 105.4,16.51 105.72,16.19 106.36,16.19 106.36,16.2 C25.2 111.91,16.2 112.16,15.95 U3.50
TDF_P
  Top 0.152: L4.1 105.41,15.08 105.57,15.24 C24.2 111.98,15.24 112.19,15.45 U3.51
TDON
  Top 0.152: J1.10 17.95,11.28 18.1,11.43 18.1,12.22 18.57,12.7 22.54,12.7 27.78,17.94 27.78,25.88 34.92,33.02 68.58,33.02 77.95,23.65 80.17,23.65 81.28,24.77 R5.1
TXD  (via drill 0.25)
  Top 0.152: U3.31 v141.2,15.95 | v150.41,15.95 151.85,15.95 R24.2
  Bottom 0.152: v141.2,15.95 v150.41,15.95
TXOUT
  Top 0.152: R24.1 J4.1
V24ADJ
  Top 0.152: PS1.5 64.61,17.94 65.75,16.8 R1.2 R1.3
VMAIN_N
  Top 0.152: 40.97,20.33 PS1.2 | 36.51,18.1 D2.A
  Top 0.203: D3.C TP_VN.1 6.35,7.62 9.85,7.62 J1.X6 | 40.97,20.33 Q1.2 36.51,18.1
  Bottom 1.27: J1.X6 14.22,2.29 15.24,1.27 22.86,1.27 C1.- 35.88,14.29 35.88,15.08 PS1.2
VMAIN_P
  Top 0.152: 40.32,15.56 40.88,15 | R14.1
  Top 0.203: TP_VP.1 R14.1 | R2.2 40.32,15.56 | J1.X1 20.31,2.54 19.05,1.27 11.91,1.27 6.83,6.35 4.45,6.35 3.49,7.3 3.49,18.73 3.97,19.21 R14.1
  Top 1.27: J1.X1 20.31,2.23 21.27,1.27 27.94,1.27 C1.+ 36.67,10 36.67,10.79 40.88,15 PS1.3
  Bottom 0.152: 41.27,12.07 R15.1
  Bottom 0.203: PS1.3 41.27,12.07

### Text on the board
_tsilk: L3 | C15 | U4 | C23 | C33 | R28 | C20 | C21 | OSC1 | C22 | C27 | R25 | GND | C18 | C19 | C16 | C17 | J3 | RXI | TXO | L5 | C25 | C24 | J4 | R30 | D12 | R24 | L4 | C28 | R27 | D11 | R22 | R17 | C30 | R23 | C29 | D10 | R26 | U3 | * | D13 | C26
_bsilk: GND | RXI | TXO